# EAGLE design vent bjt2 i2c pwm (EAGLE 9.5.0)
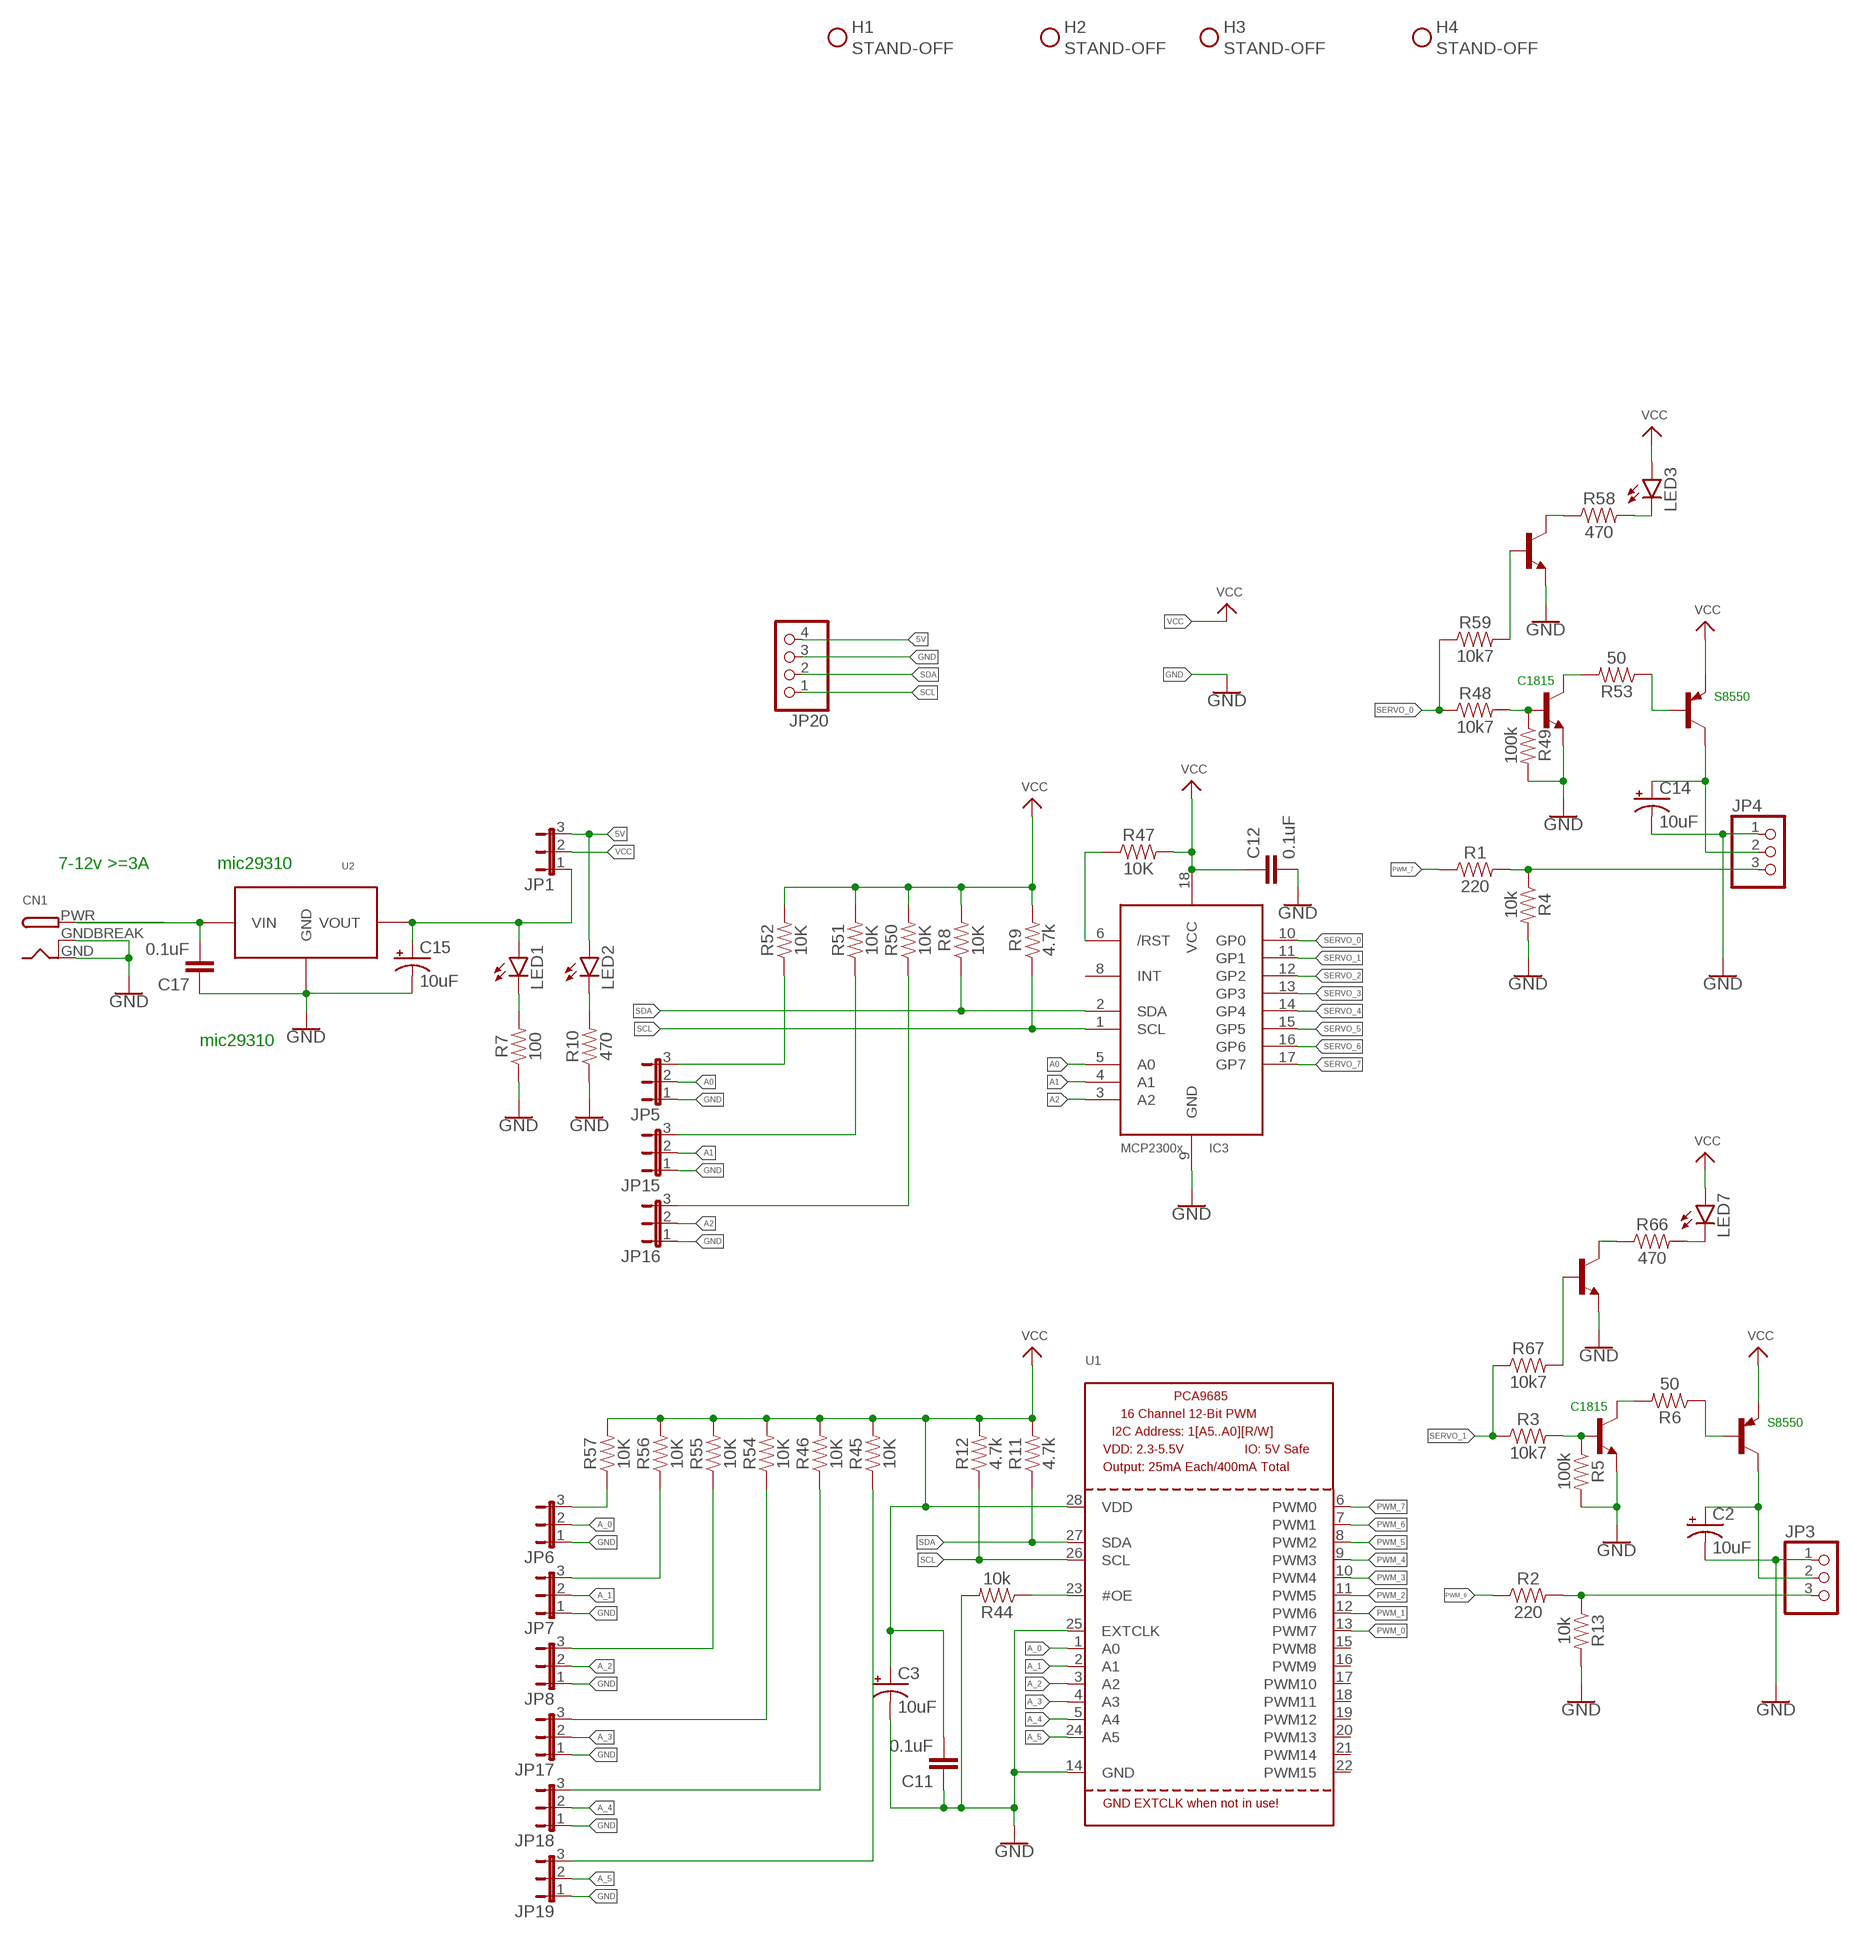
[diagram p0: schematic, sheet 1, part 1 of 2]
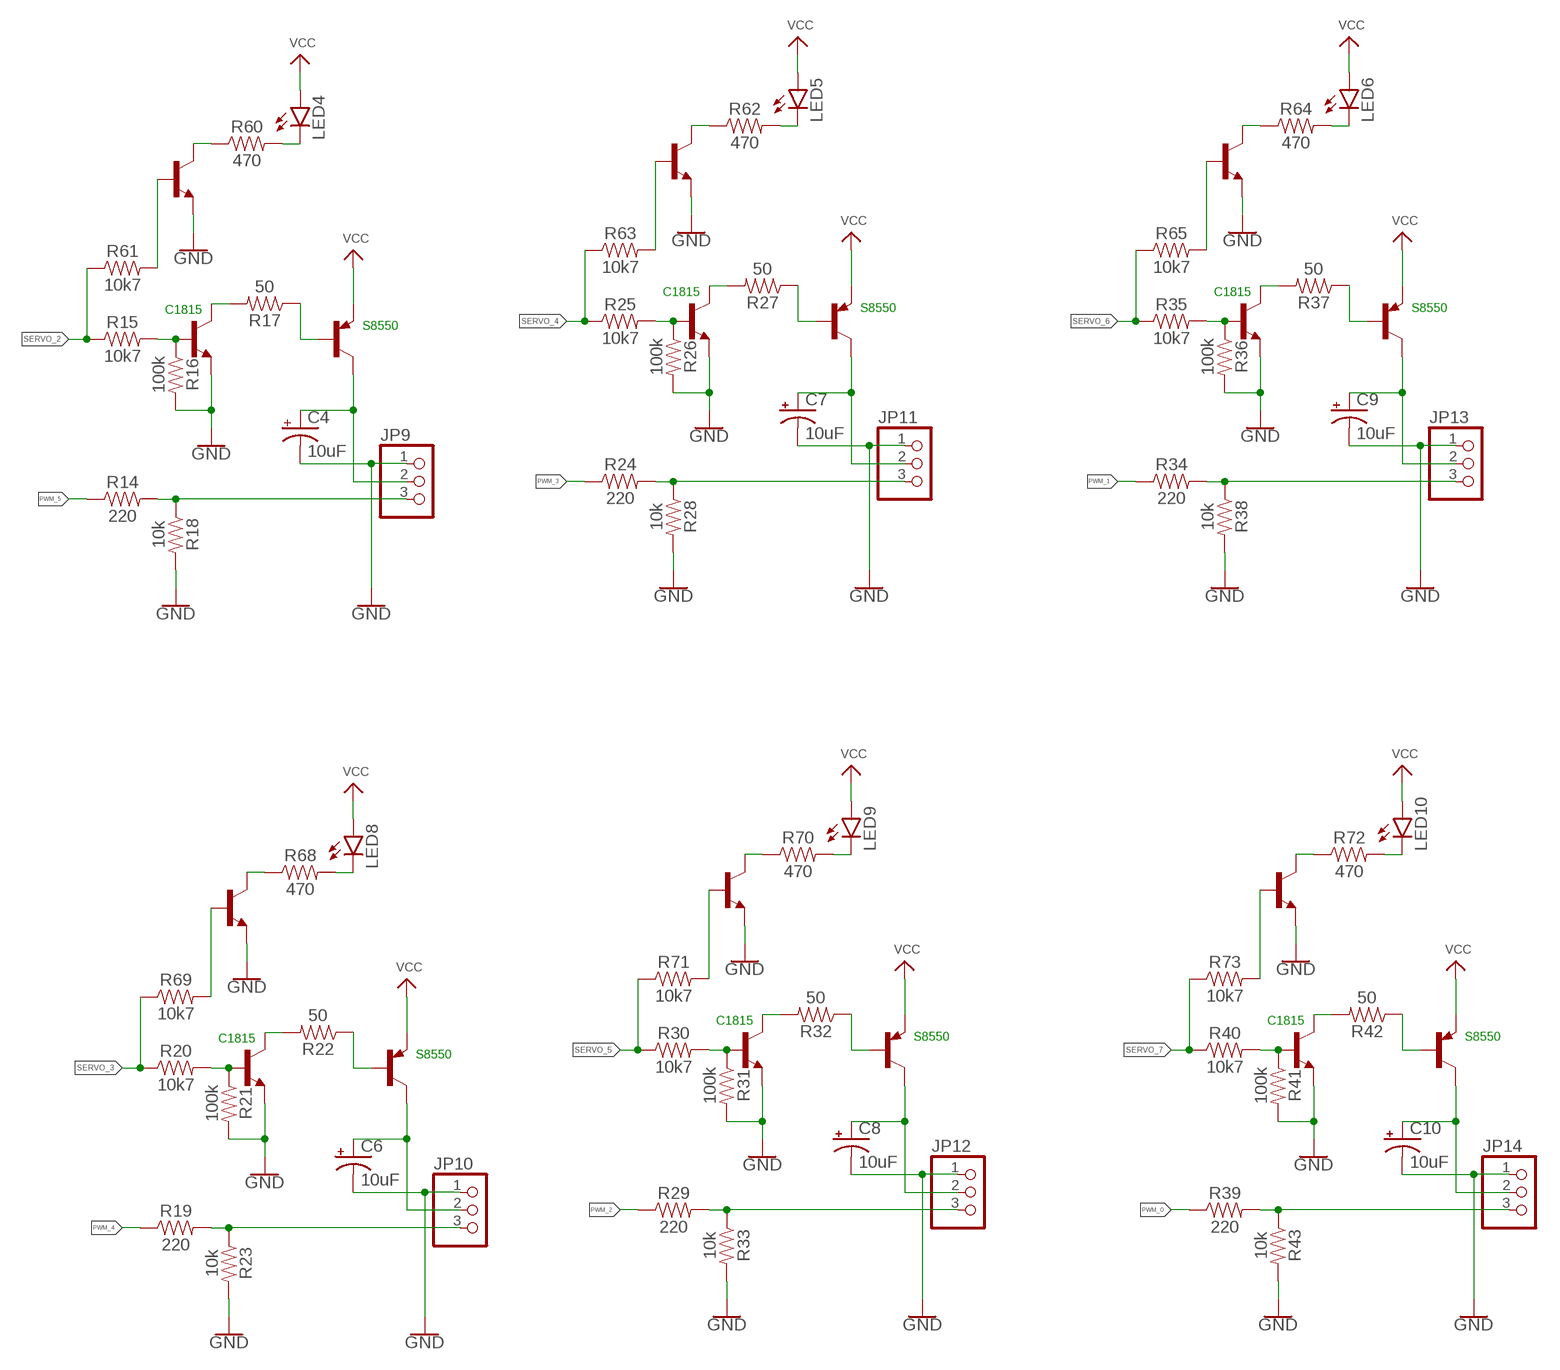
[diagram p1: schematic, sheet 1, part 2 of 2]

## Parts
C2  10uF  10UF-POLAR-RADIAL-2.5MM-25V-20%  [CPOL-RADIAL-2.5MM-5MM]
C3  10uF  10UF-POLAR-RADIAL-2.5MM-25V-20%  [CPOL-RADIAL-2.5MM-5MM]
C4  10uF  10UF-POLAR-RADIAL-2.5MM-25V-20%  [CPOL-RADIAL-2.5MM-5MM]
C6  10uF  10UF-POLAR-RADIAL-2.5MM-25V-20%  [CPOL-RADIAL-2.5MM-5MM]
C7  10uF  10UF-POLAR-RADIAL-2.5MM-25V-20%  [CPOL-RADIAL-2.5MM-5MM]
C8  10uF  10UF-POLAR-RADIAL-2.5MM-25V-20%  [CPOL-RADIAL-2.5MM-5MM]
C9  10uF  10UF-POLAR-RADIAL-2.5MM-25V-20%  [CPOL-RADIAL-2.5MM-5MM]
C10  10uF  10UF-POLAR-RADIAL-2.5MM-25V-20%  [CPOL-RADIAL-2.5MM-5MM]
C11  0.1uF  0.1UF-KIT-EZ-50V-20%  [CAP-PTH-SMALL-KIT]
C12  0.1uF  0.1UF-KIT-EZ-50V-20%  [CAP-PTH-SMALL-KIT]
C14  10uF  10UF-POLAR-RADIAL-2.5MM-25V-20%  [CPOL-RADIAL-2.5MM-5MM]
C15  10uF  10UF-POLAR-RADIAL-2.5MM-25V-20%  [CPOL-RADIAL-2.5MM-5MM]
C17  0.1uF  0.1UF-KIT-EZ-50V-20%  [CAP-PTH-SMALL-KIT]
CN1  DCBARRELPTH  [DCJACK_2MM_PTH]
H1  STAND-OFF  [STAND-OFF]
H2  STAND-OFF  [STAND-OFF]
H3  STAND-OFF  [STAND-OFF]
H4  STAND-OFF  [STAND-OFF]
IC3  MCP23008/P  [DIL18]
JP1  JP2E  [JP2]
JP3  PINHD-1X3  [1X03]
JP4  PINHD-1X3  [1X03]
JP5  JP2E  [JP2]
JP6  JP2E  [JP2]
JP7  JP2E  [JP2]
JP8  JP2E  [JP2]
JP9  PINHD-1X3  [1X03]
JP10  PINHD-1X3  [1X03]
JP11  PINHD-1X3  [1X03]
JP12  PINHD-1X3  [1X03]
JP13  PINHD-1X3  [1X03]
JP14  PINHD-1X3  [1X03]
JP15  JP2E  [JP2]
JP16  JP2E  [JP2]
JP17  JP2E  [JP2]
JP18  JP2E  [JP2]
JP19  JP2E  [JP2]
JP20  PINHD-1X4  [1X04]
LED1  LEDCHIPLED_1206  [CHIPLED_1206]
LED2  LEDCHIPLED_1206  [CHIPLED_1206]
LED3  LEDCHIPLED_1206  [CHIPLED_1206]
LED4  LEDCHIPLED_1206  [CHIPLED_1206]
LED5  LEDCHIPLED_1206  [CHIPLED_1206]
LED6  LEDCHIPLED_1206  [CHIPLED_1206]
LED7  LEDCHIPLED_1206  [CHIPLED_1206]
LED8  LEDCHIPLED_1206  [CHIPLED_1206]
LED9  LEDCHIPLED_1206  [CHIPLED_1206]
LED10  LEDCHIPLED_1206  [CHIPLED_1206]
Q1  2N2907  [TO92-EBC-OVAL]
Q2  2N2907  [TO92-EBC-OVAL]
Q3  2N2907  [TO92-EBC-OVAL]
Q4  2N2907  [TO92-EBC-OVAL]
Q5  2N2907  [TO92-EBC-OVAL]
Q6  2N2907  [TO92-EBC-OVAL]
Q7  2N2907  [TO92-EBC-OVAL]
Q9  2N2907  [TO92-EBC-OVAL]
R1  220  10KOHM-HORIZ-1/4W-1%  [AXIAL-0.3]
R2  220  10KOHM-HORIZ-1/4W-1%  [AXIAL-0.3]
R3  10k7  10KOHM-HORIZ-1/4W-1%  [AXIAL-0.3]
R4  10k  10KOHM-HORIZ-1/4W-1%  [AXIAL-0.3]
R5  100k  10KOHM-HORIZ-1/4W-1%  [AXIAL-0.3]
R6  50  10KOHM-HORIZ-1/4W-1%  [AXIAL-0.3]
R7  100  10KOHM-HORIZ-1/4W-1%  [AXIAL-0.3]
R8  10K  10KOHM-HORIZ-1/4W-1%  [AXIAL-0.3]
R9  4.7k  10KOHM-HORIZ-1/4W-1%  [AXIAL-0.3]
R10  470  10KOHM-HORIZ-1/4W-1%  [AXIAL-0.3]
R11  4.7k  10KOHM-HORIZ-1/4W-1%  [AXIAL-0.3]
R12  4.7k  10KOHM-HORIZ-1/4W-1%  [AXIAL-0.3]
R13  10k  10KOHM-HORIZ-1/4W-1%  [AXIAL-0.3]
R14  220  10KOHM-HORIZ-1/4W-1%  [AXIAL-0.3]
R15  10k7  10KOHM-HORIZ-1/4W-1%  [AXIAL-0.3]
R16  100k  10KOHM-HORIZ-1/4W-1%  [AXIAL-0.3]
R17  50  10KOHM-HORIZ-1/4W-1%  [AXIAL-0.3]
R18  10k  10KOHM-HORIZ-1/4W-1%  [AXIAL-0.3]
R19  220  10KOHM-HORIZ-1/4W-1%  [AXIAL-0.3]
R20  10k7  10KOHM-HORIZ-1/4W-1%  [AXIAL-0.3]
R21  100k  10KOHM-HORIZ-1/4W-1%  [AXIAL-0.3]
R22  50  10KOHM-HORIZ-1/4W-1%  [AXIAL-0.3]
R23  10k  10KOHM-HORIZ-1/4W-1%  [AXIAL-0.3]
R24  220  10KOHM-HORIZ-1/4W-1%  [AXIAL-0.3]
R25  10k7  10KOHM-HORIZ-1/4W-1%  [AXIAL-0.3]
R26  100k  10KOHM-HORIZ-1/4W-1%  [AXIAL-0.3]
R27  50  10KOHM-HORIZ-1/4W-1%  [AXIAL-0.3]
R28  10k  10KOHM-HORIZ-1/4W-1%  [AXIAL-0.3]
R29  220  10KOHM-HORIZ-1/4W-1%  [AXIAL-0.3]
R30  10k7  10KOHM-HORIZ-1/4W-1%  [AXIAL-0.3]
R31  100k  10KOHM-HORIZ-1/4W-1%  [AXIAL-0.3]
R32  50  10KOHM-HORIZ-1/4W-1%  [AXIAL-0.3]
R33  10k  10KOHM-HORIZ-1/4W-1%  [AXIAL-0.3]
R34  220  10KOHM-HORIZ-1/4W-1%  [AXIAL-0.3]
R35  10k7  10KOHM-HORIZ-1/4W-1%  [AXIAL-0.3]
R36  100k  10KOHM-HORIZ-1/4W-1%  [AXIAL-0.3]
R37  50  10KOHM-HORIZ-1/4W-1%  [AXIAL-0.3]
R38  10k  10KOHM-HORIZ-1/4W-1%  [AXIAL-0.3]
R39  220  10KOHM-HORIZ-1/4W-1%  [AXIAL-0.3]
R40  10k7  10KOHM-HORIZ-1/4W-1%  [AXIAL-0.3]
R41  100k  10KOHM-HORIZ-1/4W-1%  [AXIAL-0.3]
R42  50  10KOHM-HORIZ-1/4W-1%  [AXIAL-0.3]
R43  10k  10KOHM-HORIZ-1/4W-1%  [AXIAL-0.3]
R44  10k  10KOHM-HORIZ-1/4W-1%  [AXIAL-0.3]
R45  10K  10KOHM-HORIZ-1/4W-1%  [AXIAL-0.3]
R46  10K  10KOHM-HORIZ-1/4W-1%  [AXIAL-0.3]
R47  10K  10KOHM-HORIZ-1/4W-1%  [AXIAL-0.3]
R48  10k7  10KOHM-HORIZ-1/4W-1%  [AXIAL-0.3]
R49  100k  10KOHM-HORIZ-1/4W-1%  [AXIAL-0.3]
R50  10K  10KOHM-HORIZ-1/4W-1%  [AXIAL-0.3]
R51  10K  10KOHM-HORIZ-1/4W-1%  [AXIAL-0.3]
R52  10K  10KOHM-HORIZ-1/4W-1%  [AXIAL-0.3]
R53  50  10KOHM-HORIZ-1/4W-1%  [AXIAL-0.3]
R54  10K  10KOHM-HORIZ-1/4W-1%  [AXIAL-0.3]
R55  10K  10KOHM-HORIZ-1/4W-1%  [AXIAL-0.3]
R56  10K  10KOHM-HORIZ-1/4W-1%  [AXIAL-0.3]
R57  10K  10KOHM-HORIZ-1/4W-1%  [AXIAL-0.3]
R58  470  10KOHM-HORIZ-1/4W-1%  [AXIAL-0.3]
R59  10k7  10KOHM-HORIZ-1/4W-1%  [AXIAL-0.3]
R60  470  10KOHM-HORIZ-1/4W-1%  [AXIAL-0.3]
R61  10k7  10KOHM-HORIZ-1/4W-1%  [AXIAL-0.3]
R62  470  10KOHM-HORIZ-1/4W-1%  [AXIAL-0.3]
R63  10k7  10KOHM-HORIZ-1/4W-1%  [AXIAL-0.3]
R64  470  10KOHM-HORIZ-1/4W-1%  [AXIAL-0.3]
R65  10k7  10KOHM-HORIZ-1/4W-1%  [AXIAL-0.3]
R66  470  10KOHM-HORIZ-1/4W-1%  [AXIAL-0.3]
R67  10k7  10KOHM-HORIZ-1/4W-1%  [AXIAL-0.3]
R68  470  10KOHM-HORIZ-1/4W-1%  [AXIAL-0.3]
R69  10k7  10KOHM-HORIZ-1/4W-1%  [AXIAL-0.3]
R70  470  10KOHM-HORIZ-1/4W-1%  [AXIAL-0.3]
R71  10k7  10KOHM-HORIZ-1/4W-1%  [AXIAL-0.3]
R72  470  10KOHM-HORIZ-1/4W-1%  [AXIAL-0.3]
R73  10k7  10KOHM-HORIZ-1/4W-1%  [AXIAL-0.3]
T1  2SC1815  [TO92-ECB]
T2  2SC1815  [TO92-ECB]
T3  2SC1815  [TO92-ECB]
T4  2SC1815  [TO92-ECB]
T5  2SC1815  [TO92-ECB]
T6  2SC1815  [TO92-ECB]
T7  2SC1815  [TO92-ECB]
T9  2SC1815  [TO92-ECB]
U1  PCA9685  [TSSOP28]
U2  MIC29310_TO-263  [TO263-3]
U3  S9018  [TO92-EBC]
U4  S9018  [TO92-EBC]
U5  S9018  [TO92-EBC]
U6  S9018  [TO92-EBC]
U7  S9018  [TO92-EBC]
U8  S9018  [TO92-EBC]
U9  S9018  [TO92-EBC]
U10  S9018  [TO92-EBC]

## Nets
5V [power]: JP1.3 JP20.4 LED2.A
5V_REG [HI_POWER]: C15.1(+) JP1.1 LED1.A U2.3(VOUT)
A0 [Signal]: IC3.5(A0) JP5.2
A1 [Signal]: IC3.4(A1) JP15.2
A2 [Signal]: IC3.3(A2) JP16.2
A_0 [Signal]: JP6.2 U1.1(A0)
A_1 [Signal]: JP7.2 U1.2(A1)
A_2 [Signal]: JP8.2 U1.3(A2)
A_3 [Signal]: JP17.2 U1.4(A3)
A_4 [Signal]: JP18.2 U1.5(A4)
A_5 [Signal]: JP19.2 U1.24(A5)
GND [HI_POWER]: C2.2(-) C3.2(-) C4.2(-) C6.2(-) C7.2(-) C8.2(-) C9.2(-) C10.2(-) C11.1 C12.2 C14.2(-) C15.2(-) C17.1 CN1.GND CN1.GNDBREAK IC3.9(GND) JP3.1 JP4.1 JP5.1 JP6.1 JP7.1 JP8.1 JP9.1 JP10.1 JP11.1 JP12.1 JP13.1 JP14.1 JP15.1 JP16.1 JP17.1 JP18.1 JP19.1 JP20.3 R4.P$2 R5.P$2 R7.P$1 R10.P$1 R13.P$2 R16.P$2 R18.P$2 R21.P$2 R23.P$2 R26.P$2 R28.P$2 R31.P$2 R33.P$2 R36.P$2 R38.P$2 R41.P$2 R43.P$2 R44.P$2 R49.P$2 T1.E T2.E T3.E T4.E T5.E T6.E T7.E T9.E U1.14(GND) U1.25(EXTCLK) U2.2(GND) U2.TAB(GND) U3.E U4.E U5.E U6.E U7.E U8.E U9.E U10.E
N$1 [Signal]: JP4.3 R1.P$2 R4.P$1
N$2 [Signal]: JP3.3 R2.P$2 R13.P$1
N$3 [power]: Q9.B R53.P$1
N$4 [Signal]: R3.P$2 R5.P$1 T1.B
N$5 [power]: R6.P$2 T1.C
N$6 [Signal]: JP8.3 R55.P$1
N$7 [power]: C2.1(+) JP3.2 Q1.C
N$8 [HI_POWER]: C17.2 CN1.PWR U2.1(VIN)
N$9 [power]: Q1.B R6.P$1
N$10 [Signal]: JP9.3 R14.P$2 R18.P$1
N$11 [Signal]: JP6.3 R57.P$1
N$12 [Signal]: JP7.3 R56.P$1
N$13: R44.P$1 U1.23(#OE)
N$14 [Signal]: LED1.C R7.P$2
N$15 [Signal]: LED2.C R10.P$2
N$16 [power]: R58.P$1 U3.C
N$18 [Signal]: JP17.3 R54.P$1
N$19 [Signal]: JP18.3 R46.P$1
N$20 [Signal]: R15.P$2 R16.P$1 T2.B
N$21 [power]: R17.P$2 T2.C
N$22 [power]: C4.1(+) JP9.2 Q2.C
N$23 [power]: Q2.B R17.P$1
N$24: JP10.3 R19.P$2 R23.P$1
N$25 [power]: R20.P$2 R21.P$1 T3.B
N$26 [power]: R22.P$2 T3.C
N$27 [power]: C6.1(+) JP10.2 Q3.C
N$28 [power]: Q3.B R22.P$1
N$29: JP11.3 R24.P$2 R28.P$1
N$30 [power]: R25.P$2 R26.P$1 T4.B
N$31 [power]: R27.P$2 T4.C
N$32 [power]: C7.1(+) JP11.2 Q4.C
N$33 [power]: Q4.B R27.P$1
N$34: JP12.3 R29.P$2 R33.P$1
N$35 [power]: R30.P$2 R31.P$1 T5.B
N$36 [power]: R32.P$2 T5.C
N$37 [power]: C8.1(+) JP12.2 Q5.C
N$38 [power]: Q5.B R32.P$1
N$39: JP13.3 R34.P$2 R38.P$1
N$40 [power]: R35.P$2 R36.P$1 T6.B
N$41: R37.P$2 T6.C
N$42 [power]: C9.1(+) JP13.2 Q6.C
N$43 [power]: Q6.B R37.P$1
N$44 [Signal]: JP19.3 R45.P$1
N$45 [Signal]: JP5.3 R52.P$1
N$46 [Signal]: JP15.3 R51.P$1
N$47 [Signal]: JP16.3 R50.P$1
N$48 [Signal]: IC3.6(/RST) R47.P$1
N$49: JP14.3 R39.P$2 R43.P$1
N$50 [Signal]: R48.P$2 R49.P$1 T9.B
N$51 [power]: R53.P$2 T9.C
N$52 [power]: R40.P$2 R41.P$1 T7.B
N$53 [power]: C14.1(+) JP4.2 Q9.C
N$54 [power]: R42.P$2 T7.C
N$55 [power]: C10.1(+) JP14.2 Q7.C
N$56 [power]: Q7.B R42.P$1
N$57 [power]: LED3.C R58.P$2
N$58 [Signal]: R59.P$2 U3.B
N$59 [power]: R60.P$1 U4.C
N$60 [power]: LED4.C R60.P$2
N$61 [Signal]: R61.P$2 U4.B
N$62: R62.P$1 U5.C
N$63: LED5.C R62.P$2
N$64: R63.P$2 U5.B
N$65: R64.P$1 U6.C
N$66: LED6.C R64.P$2
N$67: R65.P$2 U6.B
N$68 [power]: R66.P$1 U7.C
N$69 [power]: LED7.C R66.P$2
N$70 [Signal]: R67.P$2 U7.B
N$71: R68.P$1 U8.C
N$72: LED8.C R68.P$2
N$73: R69.P$2 U8.B
N$74: R70.P$1 U9.C
N$75: LED9.C R70.P$2
N$76: R71.P$2 U9.B
N$77: R72.P$1 U10.C
N$78: LED10.C R72.P$2
N$79: R73.P$2 U10.B
PWM_0 [Signal]: R39.P$1 U1.13(PWM7)
PWM_1 [Signal]: R34.P$1 U1.12(PWM6)
PWM_2 [Signal]: R29.P$1 U1.11(PWM5)
PWM_3 [Signal]: R24.P$1 U1.10(PWM4)
PWM_4 [Signal]: R19.P$1 U1.9(PWM3)
PWM_5 [Signal]: R14.P$1 U1.8(PWM2)
PWM_6 [Signal]: R2.P$1 U1.7(PWM1)
PWM_7 [Signal]: R1.P$1 U1.6(PWM0)
SCL [Signal]: IC3.1(SCL) JP20.1 R9.P$1 R12.P$1 U1.26(SCL)
SDA [Signal]: IC3.2(SDA) JP20.2 R8.P$1 R11.P$1 U1.27(SDA)
SERVO_0 [Signal]: IC3.10(GP0) R48.P$1 R59.P$1
SERVO_1 [Signal]: IC3.11(GP1) R3.P$1 R67.P$1
SERVO_2 [Signal]: IC3.12(GP2) R15.P$1 R61.P$1
SERVO_3 [Signal]: IC3.13(GP3) R20.P$1 R69.P$1
SERVO_4 [Signal]: IC3.14(GP4) R25.P$1 R63.P$1
SERVO_5 [Signal]: IC3.15(GP5) R30.P$1 R71.P$1
SERVO_6 [Signal]: IC3.16(GP6) R35.P$1 R65.P$1
SERVO_7 [Signal]: IC3.17(GP7) R40.P$1 R73.P$1
VCC [power]: C3.1(+) C11.2 C12.1 IC3.18(VCC) JP1.2 LED3.A LED4.A LED5.A LED6.A LED7.A LED8.A LED9.A LED10.A Q1.E Q2.E Q3.E Q4.E Q5.E Q6.E Q7.E Q9.E R8.P$2 R9.P$2 R11.P$2 R12.P$2 R45.P$2 R46.P$2 R47.P$2 R50.P$2 R51.P$2 R52.P$2 R54.P$2 R55.P$2 R56.P$2 R57.P$2 U1.28(VDD)
Unconnected: IC3.8(INT) U1.15(PWM8) U1.16(PWM9) U1.17(PWM10) U1.18(PWM11) U1.19(PWM12) U1.20(PWM13) U1.21(PWM14) U1.22(PWM15)

## Notes on the sheet
- C1815 | C1815
- C1815 | C1815 | S8550 | S8550
- S8550 | S8550
- 7-12v >=3A | mic29310
- mic29310
- C1815 | C1815
- C1815 | C1815 | S8550 | S8550
- S8550 | S8550

## Library data of the parts
C2-C4 C6-C10 C14 C15 = SparkFun-Capacitors:10UF-POLAR: 10.0µF polarized capacitors A capacitor is a passive two-terminal electrical component used to store electrical energy temporarily in an electric field.; PROD_ID: CAP-08440
C11 C12 C17 = SparkFun-Capacitors:0.1UF: 0.1µF ceramic capacitors A capacitor is a passive two-terminal electrical component used to store electrical energy temporarily in an electric field.; PROD_ID: CAP-08370
CN1 = adafruit:DCBARREL: 2.0mm DC Barrel Jack DCJACK_2MM_PTH - Through Hole Jack (4UConnector: 05537)
H1-H4 = SparkFun-Hardware:STAND-OFF: Stand Off Drill holes for mechanically mounting via screws, standoffs, etc. Note: Use the keepout ring to avoid running the screw head into surrounding components. Variant Overviews STAND-OFF - Mechanical footprint for a #4 phillips button head screw. STAND-OFF-TIGHT - Mechanical footprint for a #4 phillips button head screw, Example SparkFun Products Screw - Phillips Head (1/4", 4-40, 10 pack) <https://www.sparkfun.com/products/10453> (PRT-10453) Screw - Phillips Head (1/2", 4-40, 10 pack) <https://www.sparkfun.com/products/10452> (PRT-10452) Screw - Phillips Head (3/4", 4-40, 10 pack) <https://www.sparkfun.com/products/10451> (PRT-10451) Screw - Phillips Head (1", 4-40, 10 pack) <https://www.sparkfun.com/products/10450> (PRT-10450)
IC3 = adafruit:MCP23008: MCP23008 Inexpensive i2c i/o expander - 8 general purpose i/o pins with optional pullups
JP1 JP5-JP8 JP15-JP19 = jumper:JP2E: JUMPER
JP3 JP4 JP9-JP14 = adafruit:PINHD-1X3: PIN HEADER
JP20 = pinhead:PINHD-1X4: PIN HEADER
LED1-LED10 = led:LED: LED OSRAM: - CHIPLED LG R971, LG N971, LY N971, LG Q971, LY Q971, LO R971, LY R971 LH N974, LH R974 LS Q976, LO Q976, LY Q976 LO Q996 - Hyper CHIPLED LW Q18S LB Q993, LB Q99A, LB R99A - SideLED LS A670, LO A670, LY A670, LG A670, LP A670 LB A673, LV A673, LT A673, LW A673 LH A674 LY A675 LS A676, LA A676, LO A676, LY A676, LW A676 LS A679, LY A679, LG A679 - Hyper Micro SIDELED® LS Y876, LA Y876, LO Y876, LY Y876 LT Y87S - SmartLED LW L88C, LW L88S LB L89C, LB L89S, LG L890 LS L89K, LO L89K, LY L89K LS L896, LA L896, LO L896, LY L896 - TOPLED LS T670, LO T670, LY T670, LG T670, LP T670 LSG T670, LSP T670, LSY T670, LOP T670, LYG T670 LG T671, LOG T671, LSG T671 LB T673, LV T673, LT T673, LW T673 LH T674 LS T676, LA T676, LO T676, LY T676, LB T676, LH T676, LSB T676, LW T676 LB T67C, LV T67C, LT T67C, LS T67K, LO T67K, LY T67K, LW E67C LS E67B, LA E67B, LO E67B, LY E67B, LB E67C, LV E67C, LT E67C LW T67C LS T679, LY T679, LG T679 LS T770, LO T770, LY T770, LG T770, LP T770 LB T773, LV T773, LT T773, LW T773 LH T774 LS E675, LA E675, LY E675, LS T675 LS T776, LA T776, LO T776, LY T776, LB T776 LHGB T686 LT T68C, LB T68C - Hyper Mini TOPLED® LB M676 - Mini TOPLED Santana® LG M470 LS M47K, LO M47K, LY M47K Source: http://www.osram.convergy.de LUXEON: - LUMILED® LXK2-PW12-R00, LXK2-PW12-S00, LXK2-PW14-U00, LXK2-PW14-V00 LXK2-PM12-R00, LXK2-PM12-S00, LXK2-PM14-U00 LXK2-PE12-Q00, LXK2-PE12-R00, LXK2-PE12-S00, LXK2-PE14-T00, LXK2-PE14-U00 LXK2-PB12-K00, LXK2-PB12-L00, LXK2-PB12-M00, LXK2-PB14-N00, LXK2-PB14-P00, LXK2-PB14-Q00 LXK2-PR12-L00, LXK2-PR12-M00, LXK2-PR14-Q00, LXK2-PR14-R00 LXK2-PD12-Q00, LXK2-PD12-R00, LXK2-PD12-S00 LXK2-PH12-R00, LXK2-PH12-S00 LXK2-PL12-P00, LXK2-PL12-Q00, LXK2-PL12-R00 Source: www.luxeon.com KINGBRIGHT: KA-3528ASYC Source: www.kingbright.com
Q1-Q7 Q9 = adafruit:2N2907*: PNP Transistor Big Oval pads
R1-R3 R5-R12 R14-R17 R19-R22 R24-R27 R29-R32 R34-R37 R39-R42 R45-R73 = SparkFun-Resistors:10KOHM: 10kΩ resistor A resistor is a passive two-terminal electrical component that implements electrical resistance as a circuit element. Resistors act to reduce current flow, and, at the same time, act to lower voltage levels within circuits. - Wikipedia; PROD_ID: RES-12183; VALUE: 10k
R4 R13 R18 R23 R28 R33 R38 R43 R44 = SparkFun-Resistors:10KOHM: 10kΩ resistor A resistor is a passive two-terminal electrical component that implements electrical resistance as a circuit element. Resistors act to reduce current flow, and, at the same time, act to lower voltage levels within circuits. - Wikipedia; PROD_ID: RES-12183
T1-T7 T9 = transistor:2SC1815: NPN EPITAXIAL TRANSISTOR Source: TOSHIBA .. 2SC1815 1.pdf
U1 = adafruit:PCA9685: PCA9685 - 16 Channel 12-Bit I2C PWM Controller 5.0V tolerant 16 channel, 12-bit I2C PWM controller with 25mA per output (max. 400mA total) Digikey: 568-5931-1-ND
U2 = mic29310:MIC29310_TO-263: MIC29310-5WU LDO
U3-U10 = S9018:S9018: S9018 npn BJT

## Net classes
1 power: width 0.381 mm, drill 0.203 mm, clearance 0.203 mm
2 HI_POWER: width 0.914 mm, drill 0.203 mm, clearance 0.203 mm
3 Signal: width 0.152 mm, drill 0.203 mm, clearance 0.152 mm

## Board
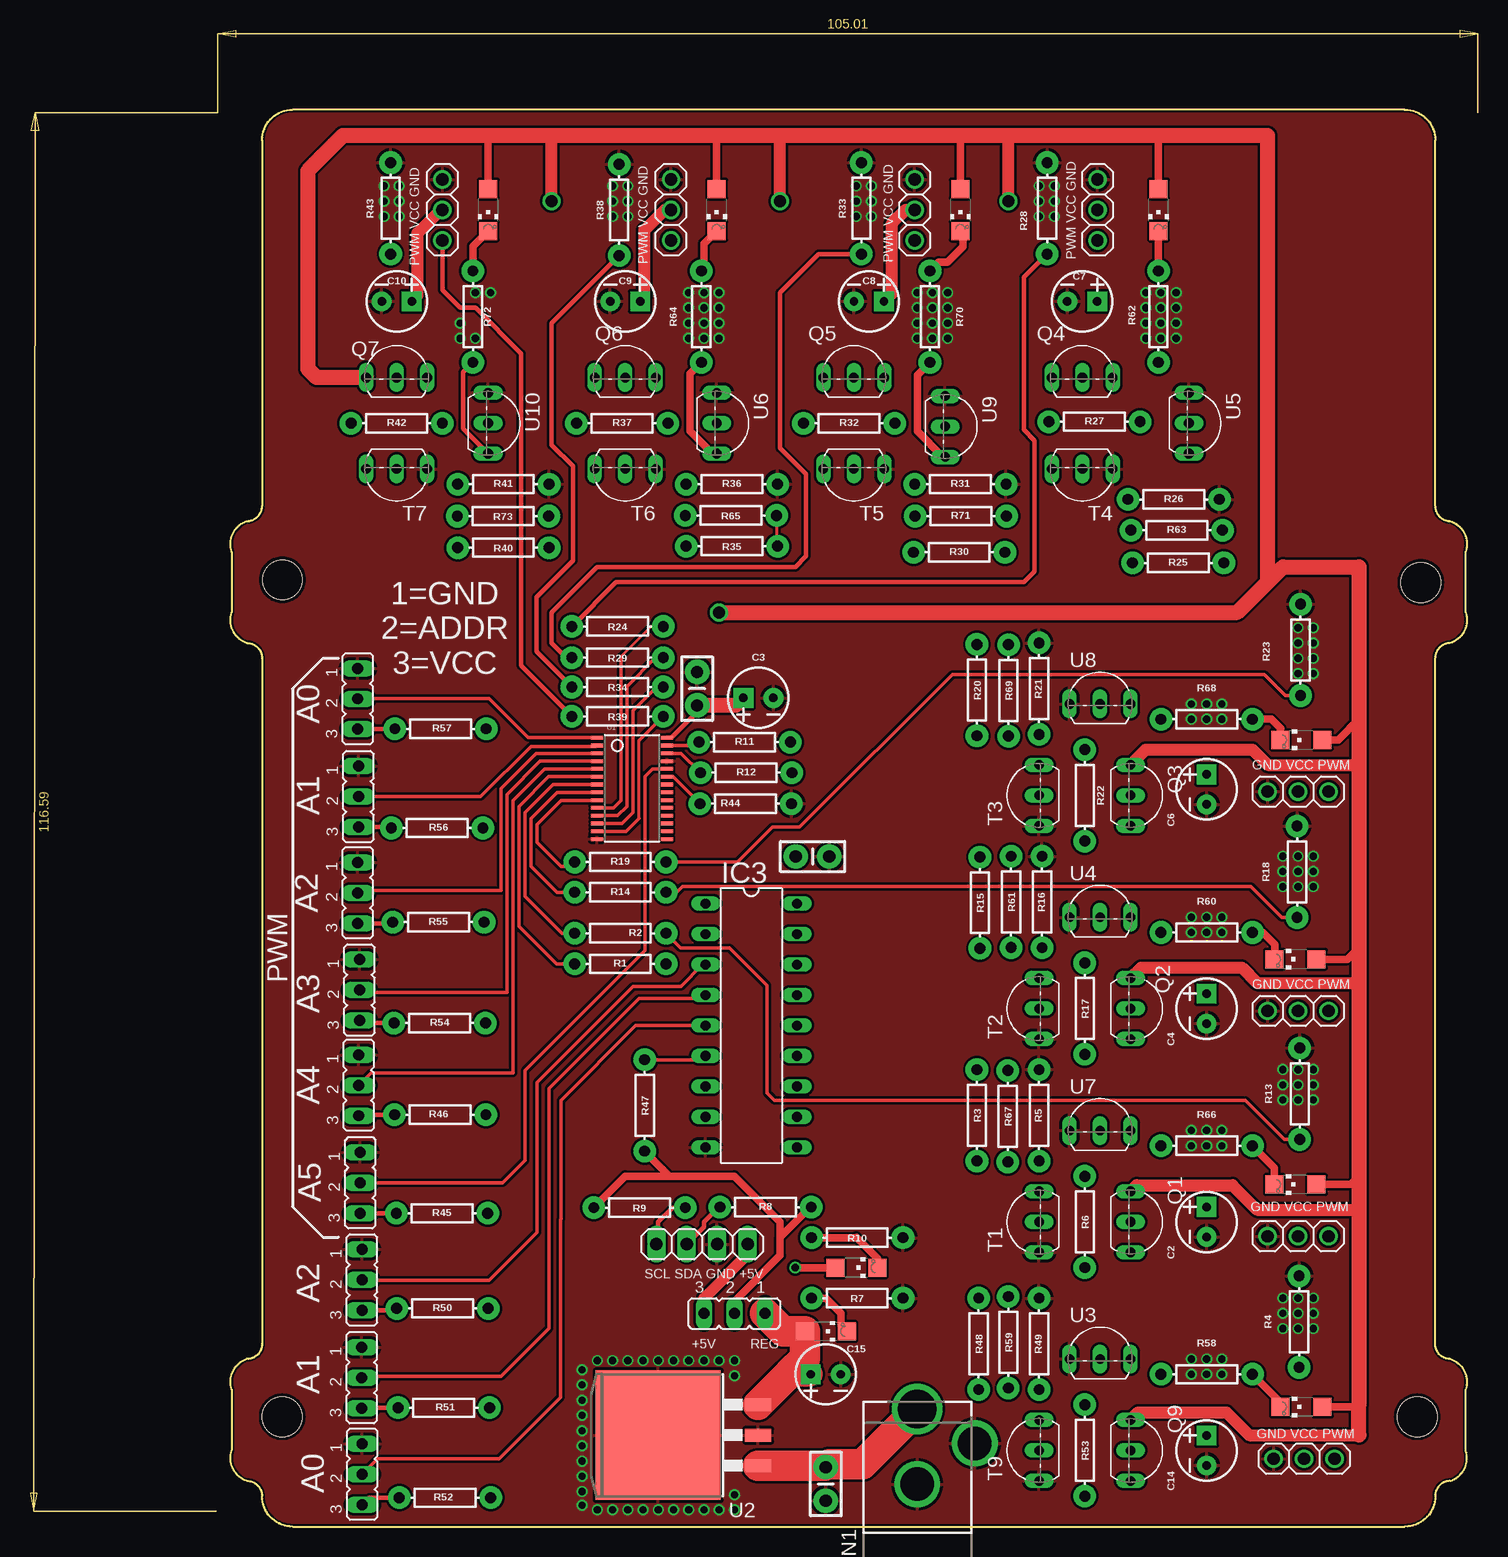
[diagram p2: board, top side]
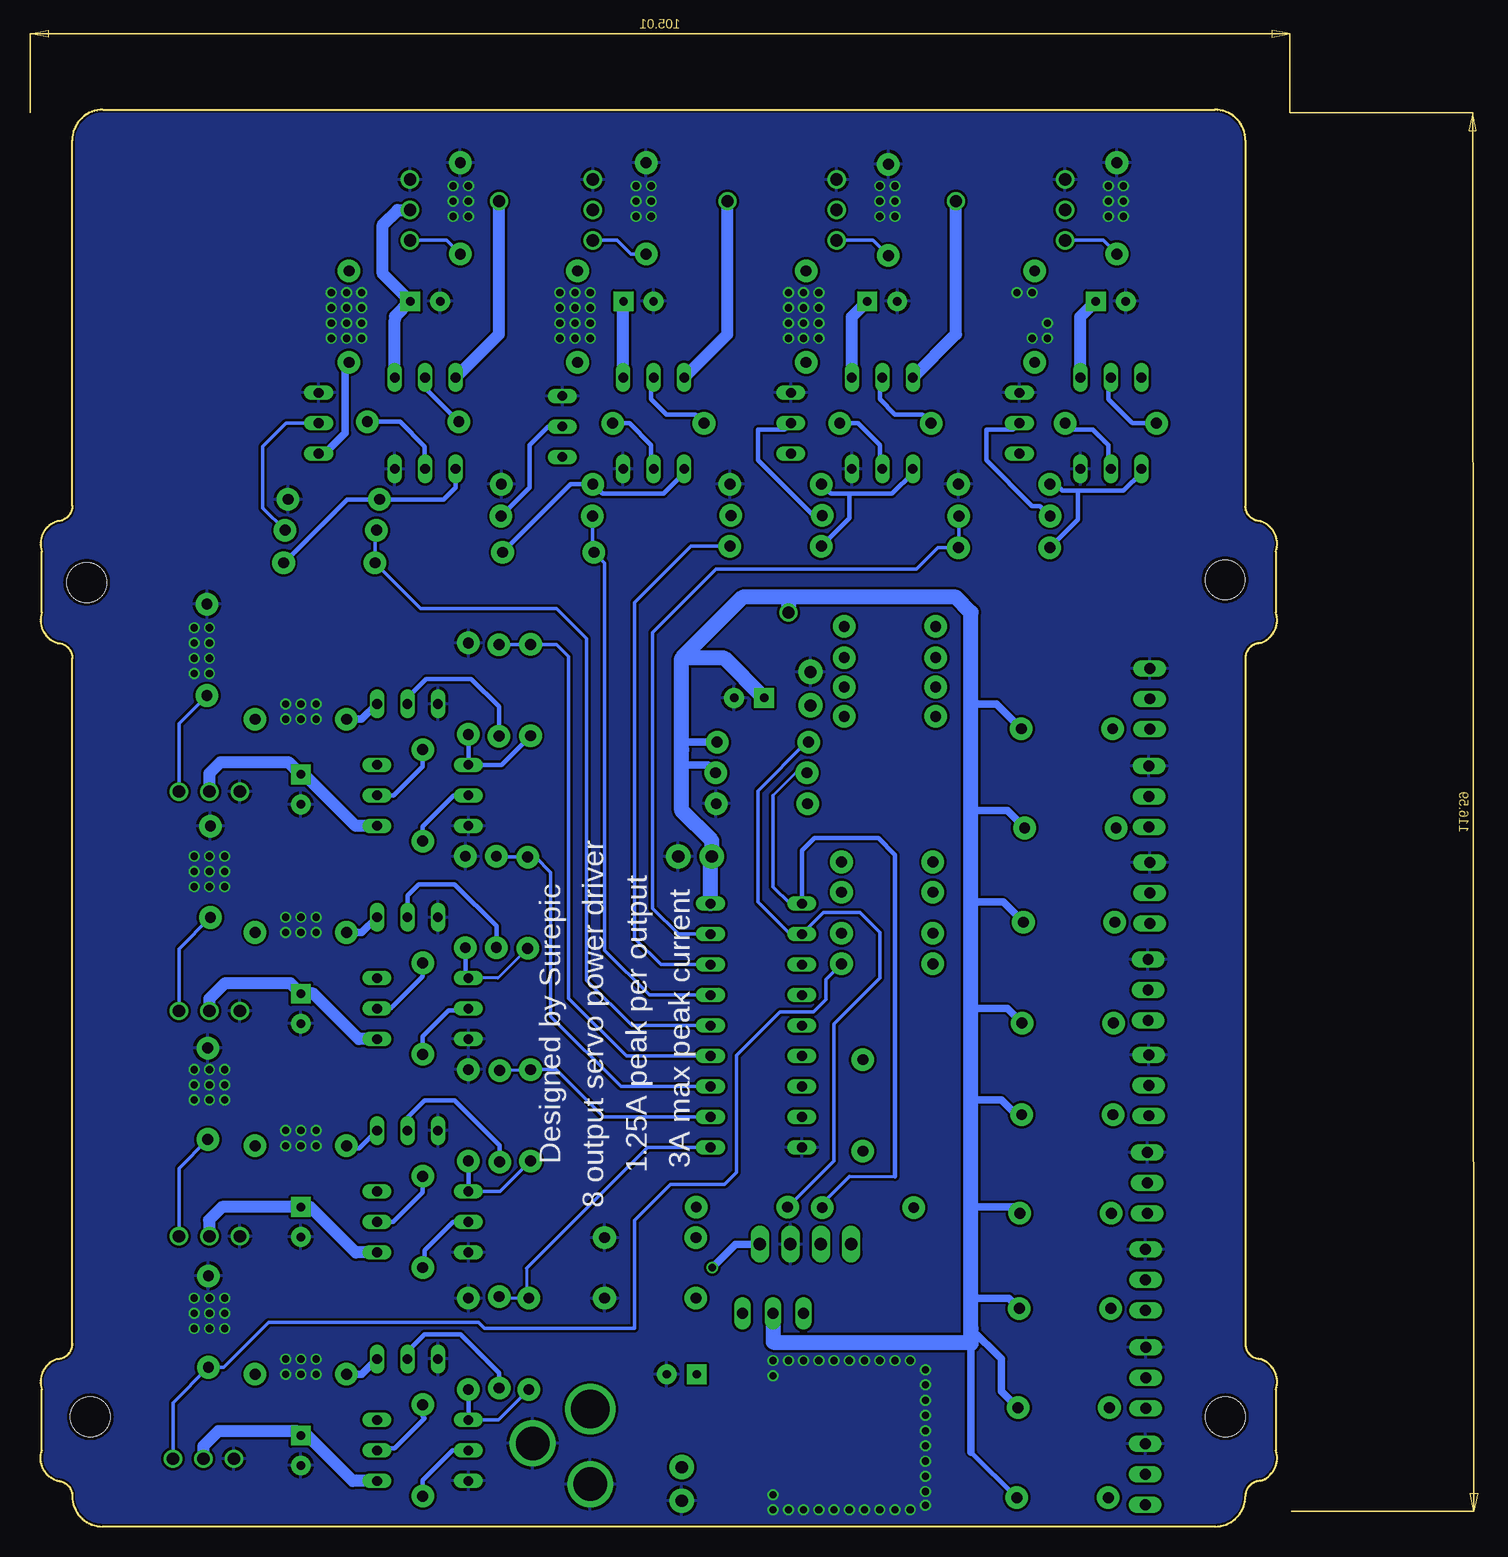
[diagram p3: board, bottom side, seen from below]

Size 103.07 x 118.11 mm. Coordinates in mm from the lower left corner, seen from the top.
Outline: 2.64,115.57 2.64,85.09 arc-90 1.37,83.82 arc90 0.1,81.28 0.1,76.2 arc90 1.37,73.66 arc-90 2.64,72.39 2.64,15.24 arc-90 1.37,13.97 arc90 0.1,11.43 0.1,6.35 arc90 1.37,3.81 arc-90 2.64,2.54 arc90 5.18,0 97.89,0 arc90 100.43,2.54 arc-90 101.7,3.81 arc90 102.97,6.35 102.97,11.43 arc90 101.7,13.97 arc-90 100.43,15.24 100.43,72.39 arc-90 101.7,73.66 arc90 102.97,76.2 102.97,81.28 arc90 101.7,83.82 arc-90 100.43,85.09 100.43,115.57 arc90 97.89,118.11 5.18,118.11 arc90 2.64,115.57
Copper layers (1*16): Top 0.035mm / dielectric 1.5mm / Bottom 0.035mm
Design rules "SparkFun-2-layer-PCBWay-LIMIT": minimum track width 6mil, minimum drill 0.3mm, track to track 6mil, track to pad 6mil, pad to pad 6mil, via to via 6mil, smd to smd 6mil, copper to edge 6mil, drill to drill 6mil, minimum pad ring 6mil, minimum via ring 6mil, stop-mask expansion 4mil, vias tented up to drill 25mil, thermal gap 10mil

### Footprints (pad centres in the part's own frame; a part is rotated, then mirrored left to right if it is on the bottom)
CPOL-RADIAL-2.5MM-5MM = drill 0.7 pad 1.651 square: 1 1.25,0 | drill 0.7 pad 1.651: 2 -1.25,0
CAP-PTH-SMALL-KIT = drill 1.016 pad 2.032: 1 -1.397,0; 2 1.397,0
DCJACK_2MM_PTH = drill 2.8: GND 0,7.35; GNDBREAK 4.8,10.75 | drill 3.2: PWR 0,13.6
STAND-OFF = hole 3.302: 0,0
DIL18 = drill 0.813 long: 1 -10.16,-3.81; 2 -7.62,-3.81; 3 -5.08,-3.81; 4 -2.54,-3.81; 5 0,-3.81; 6 2.54,-3.81; 7 5.08,-3.81; 8 7.62,-3.81; 9 10.16,-3.81; 10 10.16,3.81; 11 7.62,3.81; 12 5.08,3.81; 13 2.54,3.81; 14 0,3.81; 15 -2.54,3.81; 16 -5.08,3.81; 17 -7.62,3.81; 18 -10.16,3.81
JP2 = drill 0.914 long: 1 -2.54,0; 2 0,0; 3 2.54,0
1X03 = drill 1.016: 1 -2.54,0; 2 0,0; 3 2.54,0
1X04 = drill 1.016 long: 1 -3.81,0; 2 -1.27,0; 3 1.27,0; 4 3.81,0
CHIPLED_1206 = smd 1.5 x 1.5: A 0,-1.75; C 0,1.75
TO92-EBC-OVAL = drill 0.813 long: B 0,-1.27; C 2.54,-1.27; E -2.54,-1.27
AXIAL-0.3 = drill 0.9 pad 1.88: P$1 -3.81,0; P$2 3.81,0
TO92-ECB = drill 0.813 long: B 2.54,0; C 0,0; E -2.54,0
TSSOP28 = smd 0.305 x 0.991: 1 -4.225,-2.918; 2 -3.575,-2.918; 3 -2.925,-2.918; 4 -2.275,-2.918; 5 -1.625,-2.918; 6 -0.975,-2.918; 7 -0.325,-2.918; 8 0.325,-2.918; 9 0.975,-2.918; 10 1.625,-2.918; 11 2.275,-2.918; 12 2.925,-2.918; 13 3.575,-2.918; 14 4.225,-2.918; 15 4.225,2.918; 16 3.575,2.918; 17 2.925,2.918; 18 2.275,2.918; 19 1.625,2.918; 20 0.975,2.918; 21 0.325,2.918; 22 -0.325,2.918; 23 -0.975,2.918; 24 -1.625,2.918; 25 -2.275,2.918; 26 -2.925,2.918; 27 -3.575,2.918; 28 -4.225,2.918
TO263-3 = smd 1.067 x 2.159: 1 -2.54,-5.791; 2 0,-5.791; 3 2.54,-5.791 | smd 10.8 x 10.41: TAB 0,2.54
TO92-EBC = drill 0.813 long: B 0,-1.27; C 2.54,-1.27; E -2.54,-1.27

### Placement (x,y rotation side)
C2  81.38,25.4 90 top
C3  44.01,69.08 180 top
C4  81.38,43.18 90 top
C6  81.38,61.46 90 top
C7  71.01,102.14 0 top
C8  53.23,102.14 0 top
C9  32.91,102.14 0 top
C10  13.86,102.14 0 top
C11  38.9,69.85 270 top
C12  48.52,55.86 0 top
C14  81.38,6.35 90 top
C15  49.63,12.7 180 top
C17  49.63,3.56 90 top
CN1  57.25,-3.81 0 top
H1  99.23,78.71 0 top
H2  98.93,9.16 0 top
H3  4.31,9.16 0 top
H4  4.33,78.93 0 top
IC3  43.42,41.77 270 top
JP1  42.01,17.78 180 top
JP3  89,24.21 0 top
JP4  89.5,5.66 0 top
JP5  10.99,4.38 270 top
JP6  10.62,69.01 270 top
JP7  10.67,60.85 270 top
JP8  10.62,52.84 270 top
JP9  89,42.99 0 top
JP10  89,61.27 0 top
JP11  72.28,109.76 270 top
JP12  57.04,109.76 270 top
JP13  36.72,109.76 270 top
JP14  17.67,109.76 270 top
JP15  10.95,12.42 270 top
JP16  10.97,20.56 270 top
JP17  10.75,44.73 270 top
JP18  10.7,36.8 270 top
JP19  10.83,28.66 270 top
JP20  39.31,23.55 0 top
LED1  49.63,16.28 270 top
LED2  52.17,21.59 270 top
LED3  89.27,9.98 90 top
LED4  88.77,47.3 90 top
LED5  77.36,109.76 180 top
LED6  40.53,109.76 180 top
LED7  88.77,28.52 90 top
LED8  89.27,65.58 90 top
LED9  60.85,109.76 180 top
LED10  21.48,109.76 180 top
Q1  76.3,25.4 270 top
Q2  76.3,43.18 270 top
Q3  76.3,60.96 270 top
Q4  71.01,97.06 0 top
Q5  51.96,97.06 0 top
Q6  32.91,97.06 0 top
Q7  13.86,97.06 0 top
Q9  76.3,6.35 270 top
R1  32.5,46.91 0 top
R2  32.5,49.46 0 top
R3  62.23,34.29 270 top
R4  89.09,17.09 90 top
R5  67.41,34.29 90 top
R6  71.22,25.4 270 top
R7  52.25,19.05 180 top
R8  44.61,26.63 0 top
R9  34.1,26.59 180 top
R10  52.25,24.09 180 top
R11  42.87,65.4 0 top
R12  43,62.85 0 top
R13  89.14,36.09 90 top
R14  32.5,52.88 0 top
R15  62.48,52.01 270 top
R16  67.67,52.07 90 top
R17  71.22,43.18 270 top
R18  88.92,54.59 90 top
R19  32.5,55.4 0 top
R20  62.23,69.73 270 top
R21  67.41,69.85 90 top
R22  71.22,60.96 270 top
R23  89.2,73.09 90 top
R24  32.27,75.04 180 top
R25  79,80.34 0 top
R26  78.63,85.63 0 top
R27  72.03,92.11 0 top
R28  68.09,109.89 90 top
R29  32.27,72.44 180 top
R30  60.75,81.22 0 top
R31  60.85,86.9 0 top
R32  51.58,91.98 0 top
R33  52.6,109.89 90 top
R34  32.27,69.99 180 top
R35  41.8,81.73 180 top
R36  41.8,86.9 0 top
R37  32.66,91.98 0 top
R38  32.4,109.76 90 top
R39  32.27,67.54 180 top
R40  22.75,81.61 180 top
R41  22.75,86.9 0 top
R42  13.86,91.98 0 top
R43  13.35,109.89 90 top
R44  42.95,60.26 0 top
R45  17.64,26.12 0 top
R46  17.49,34.34 0 top
R47  34.53,35.11 270 top
R48  62.37,15.24 270 top
R49  67.41,15.24 90 top
R50  17.68,18.19 0 top
R51  17.79,9.91 0 top
R52  17.88,2.41 0 top
R53  71.22,6.35 270 top
R54  17.45,41.98 0 top
R55  17.34,50.39 0 top
R56  17.23,58.24 0 top
R57  17.51,66.51 0 top
R58  81.38,12.7 0 top
R59  64.85,15.37 270 top
R60  81.38,49.53 0 top
R61  65.08,52.08 270 top
R62  77.36,100.87 90 top
R63  78.88,83.06 0 top
R64  39.26,100.87 90 top
R65  41.72,84.29 180 top
R66  81.38,31.75 0 top
R67  64.8,34.21 270 top
R68  81.38,67.31 0 top
R69  64.86,69.71 270 top
R70  58.31,100.87 90 top
R71  60.88,84.24 0 top
R72  20.21,100.87 90 top
R73  22.72,84.24 180 top
T1  67.41,25.4 90 top
T2  67.41,43.18 90 top
T3  67.41,60.96 90 top
T4  71.01,88.17 180 top
T5  51.96,88.17 180 top
T6  32.91,88.17 180 top
T7  13.86,88.17 180 top
T9  67.41,6.35 90 top
U1  33.47,61.54 270 top
U2  38.2,7.62 90 top
U3  72.49,15.24 0 top
U4  72.49,52.07 0 top
U5  81.17,91.98 270 top
U6  41.8,91.98 270 top
U7  72.49,34.29 0 top
U8  72.49,69.85 0 top
U9  60.85,91.71 270 top
U10  22.75,91.98 270 top

### Tracks (layer width: path | path; a pad name or v marks a point on that pad's centre or on a via)
5V  (via drill 0.65)
  Top 0.61: v47.09,21.59 LED2.A
  Top 0.914: JP1.3 39.47,19.05 43.12,22.7 JP20.4
  Bottom 0.61: JP20.4 45.13,23.55 v47.09,21.59
5V_REG
  Top 2: 46.53,12.7 C15.1
  Top 2.54: U2.3 46.53,12.7 47.88,14.05 LED1.A 46.05,16.28 JP1.1
A0
  Top 0.254: 27.52,25.62 27.55,25.65
  Top 0.305: JP5.2 12.26,5.65 22.39,5.65 27.52,10.78 27.52,25.62 | 27.55,25.65 27.55,35.54 33.78,41.77 IC3.5
A1
  Top 0.254: 11.07,12.54 JP15.2
  Top 0.305: IC3.4 39.34,44.04 34.05,44.04 26.55,36.54 26.55,16.54 22.55,12.54 11.07,12.54
A2
  Top 0.254: 10.99,20.54 JP16.2
  Top 0.305: IC3.3 39.36,46.85 37.55,45.04 33.55,45.04 25.55,37.04 25.55,24.54 21.55,20.54 10.99,20.54
A_0
  Top 0.254: 10.65,69.04 JP6.2
  Top 0.305: U1.1 24.83,65.77 21.55,69.04 10.65,69.04
A_1
  Top 0.254: U1.2 30.48,65.04
  Top 0.305: 30.48,65.04 25.05,65.04 20.86,60.85 JP7.2
A_2
  Top 0.254: 10.82,53.04 JP8.2
  Top 0.305: U1.3 25.48,64.47 22.55,61.54 22.55,53.04 10.82,53.04
A_3
  Top 0.254: 10.94,44.54 JP17.2
  Top 0.305: U1.4 25.83,63.81 23.05,61.04 23.05,44.54 10.94,44.54
A_4
  Top 0.305: U1.5 26.18,63.16 23.55,60.54 23.55,37.81 11.71,37.81 JP18.2
A_5
  Top 0.305: JP19.2 22.67,28.66 24.55,30.54 24.55,38.04 34.55,48.04 34.55,62.54 35.18,63.16 U1.24
GND  (via drill 0.6)
  other vias: 29.31,4.19 29.31,5.46 29.31,6.73 29.31,8 29.31,9.27 29.31,10.54 29.31,11.81 29.31,13.08 29.31,2.92 29.31,1.78 30.58,1.4 31.85,1.4 33.12,1.4 34.39,1.4 35.66,1.4 36.93,1.4 38.2,1.4 39.47,1.4 40.74,1.4 42.01,1.4 42.01,2.67 42.01,12.57 30.58,13.84 31.85,13.84 33.12,13.84 34.39,13.84 35.66,13.84 36.93,13.84 38.2,13.84 39.47,13.84 40.74,13.84 42.01,13.84 80.11,13.97 81.38,13.97 82.65,13.97 80.11,12.7 81.38,12.7 82.65,12.7 87.73,19.05 87.73,17.78 87.73,16.51 90.27,16.51 89,16.51 90.27,17.78 89,17.78 90.27,19.05 89,19.05 76.3,99.06 78.84,99.06 78.84,100.33 77.57,99.06 77.57,100.33 78.84,101.6 78.84,102.87 77.57,101.6 76.3,100.33 68.68,110.49 76.3,101.6 77.57,102.87 76.3,102.87 68.68,111.76 67.41,111.76 58.52,99.06 58.52,100.33 59.79,99.06 68.68,109.22 67.41,110.49 53.44,111.76 67.41,109.22 59.79,100.33 58.52,101.6 57.25,99.06 59.79,101.6 52.17,111.76 38.2,99.06 52.17,110.49 59.79,102.87 57.25,100.33 57.25,101.6 58.52,102.87 53.44,110.49 52.17,109.22 39.47,99.06 38.2,100.33 38.2,101.6 39.47,100.33 40.74,99.06 53.44,109.22 57.25,102.87 33.12,111.76 40.74,100.33 39.47,101.6 40.74,101.6 31.85,111.76 31.85,110.49 40.74,102.87 39.47,102.87 33.12,110.49 31.85,109.22 33.12,109.22 38.2,102.87 20.42,99.06 12.8,111.76 12.8,110.49 14.07,111.76 19.15,99.06 19.15,100.33 21.69,102.87 12.8,109.22 14.07,110.49 14.07,109.22 20.42,102.87 80.11,33.02 81.38,33.02 82.65,33.02 80.11,31.75 81.38,31.75 82.65,31.75 80.11,50.8 81.38,50.8 82.65,50.8 80.11,49.53 81.38,49.53 82.65,49.53 80.11,68.58 81.38,68.58 82.65,68.58 82.65,67.31 81.38,67.31 80.11,67.31 89,74.93 89,72.39 89,73.66 90.27,74.93 90.27,73.66 90.27,72.39 90.27,71.12 89,71.12 87.73,55.88 89,55.88 90.27,55.88 90.27,54.61 89,54.61 87.73,54.61 89,53.34 90.27,53.34 87.73,38.1 87.73,36.83 87.73,35.56 89,38.1 89,36.83 89,35.56 90.27,38.1 90.27,36.83 90.27,35.56 87.73,53.34
  pour Top: -2.44,-2.54 -2.44,118.94 105.51,118.94 105.51,-2.54
  pour Bottom: -2.44,-1.27 -2.44,118.63 105.51,118.63 105.51,-1.27
N$1
  Bottom 0.305: JP4.3 92.04,10.33 R4.P$1 87.81,13.28 84.05,17.04 66.55,17.04 66.05,16.54 53.55,16.54 53.55,25.54 50.55,28.54 46.05,28.54 45.05,29.54 45.05,39.3 41.43,42.92 38.63,42.92 37.61,43.94 37.61,45.61 R1.P$2
N$2
  Top 0.305: R2.P$2 37.54,48.24 41.59,48.24 44.73,45.09 44.73,36.17 45.36,35.54 84.61,35.54 87.87,32.28 R13.P$1
  Bottom 0.305: R13.P$1 91.54,29.88 JP3.3
N$3
  Bottom 0.381: R53.P$1 71.22,9.21 71.05,9.04 73.55,6.54 74.84,6.54 Q9.B
N$4
  Bottom 0.305: R3.P$2 64.77,27.94 T1.B
  Bottom 0.381: T1.B R5.P$1
N$5
  Bottom 0.381: T1.C 68.69,25.4 71.05,23.04 71.05,21.76 R6.P$2
N$6
  Top 0.381: JP8.3 13.44,50.3 R55.P$1
N$7
  Bottom 0.381: 89.05,25.54 89,25.49
  Bottom 1.016: Q1.C 76.81,22.86 80.6,26.65 C2.1 87.94,26.65 89.05,25.54 | 89,25.49 JP3.2
N$8
  Top 1.016: 49.89,5.21 C17.2
  Top 1.27: C17.2 49.5,5.08
  Top 2.54: CN1.PWR 52.67,5.21 49.89,5.21 | 49.5,5.08 U2.1
N$9
  Bottom 0.381: R6.P$1 71.22,27.87 73.69,25.4 Q1.B
N$10
  Top 0.305: R14.P$2 37.19,52.88 37.68,53.37 85.06,53.37 87.65,50.78 R18.P$1
  Bottom 0.305: R18.P$1 91.54,48.16 JP9.3
N$11
  Top 0.381: JP6.3 13.66,66.47 R57.P$1
N$12
  Top 0.381: JP7.3 13.35,58.31 R56.P$1
N$13
  Top 0.305: U1.23 36.89,62.52 R44.P$1
N$14
  Top 0.254: LED1.C 50.9,16.76
  Top 0.61: 50.9,16.76 50.9,17.78 49.63,19.05 R7.P$2
N$15
  Top 0.254: 52.13,24.09 52.17,24.13
  Top 0.61: R10.P$2 52.13,24.09 | 52.17,24.13 53.92,22.38 LED2.C
N$16
  Bottom 0.61: U3.C 76.3,12.7 R58.P$1
N$18
  Top 0.381: JP17.3 10.96,41.98 R54.P$1
N$19
  Top 0.381: JP18.3 10.78,34.34 R46.P$1
N$20
  Bottom 0.254: R15.P$2 64.96,45.72 T2.B
  Bottom 0.381: R16.P$1 67.67,45.97 T2.B
N$21
  Bottom 0.381: T2.C 67.55,43.04 69.05,43.04 71.22,40.87 R17.P$2
N$22
  Bottom 1.016: Q2.C 76.56,40.64 80.35,44.43 C4.1 82.27,45.32 87.69,45.32 89,44.01 JP9.2
N$23
  Bottom 0.381: R17.P$1 71.22,45.87 73.91,43.18 Q2.B
N$24
  Top 0.305: R19.P$2 42.27,55.4 45.17,58.31 47.46,58.31 60.19,71.04 86.17,71.04 87.93,69.28 R23.P$1
  Bottom 0.305: R23.P$1 91.54,66.94 JP10.3
N$25
  Bottom 0.381: R21.P$1 T3.B 64.65,63.5 R20.P$2
N$26
  Bottom 0.381: T3.C 68.63,60.96 71.22,58.37 R22.P$2
N$27
  Bottom 1.016: Q3.C 76.81,58.42 81.1,62.71 C6.1 82.4,63.73 88.07,63.73 89,62.79 JP10.2
N$28
  Bottom 0.381: R22.P$1 71.22,63.37 73.63,60.96 Q3.B
N$29
  Top 0.381: R24.P$2 32.16,78.74 66.14,78.74 67.03,79.63 67.03,90.55 66.14,91.44 66.14,104.14 68.08,106.08 R28.P$1
  Bottom 0.305: R28.P$1 69.23,107.22 JP11.3
N$30
  Bottom 0.381: T4.B 68.47,86.62 69.46,85.63 R26.P$1 77.52,85.63 R25.P$2
N$31
  Bottom 0.381: T4.C 71.05,88.21 71.05,90.04 73.12,92.11 R27.P$2
N$32
  Bottom 0.381: 73.55,100.58 73.53,100.6
  Bottom 1.016: Q4.C 73.55,100.58 | 73.53,100.6 73.53,100.87 C7.1 74.55,104.43 74.55,108.54 73.33,109.76 JP11.2
N$33
  Bottom 0.381: R27.P$1 71.01,94.9 Q4.B
N$34
  Top 0.381: R29.P$2 27.99,72.44 26.77,73.66 26.77,76.2 30.58,80.01 47.09,80.01 47.98,80.9 47.98,87.76 45.82,89.92 45.82,102.87 49.03,106.08 R33.P$1
  Bottom 0.305: R33.P$1 53.87,106.08 55.01,107.22 JP12.3
N$35
  Bottom 0.381: R30.P$2 58.88,86.9 R31.P$1 56.25,86.11 51.16,86.11 49.42,87.84 T5.B
N$36
  Bottom 0.381: T5.C 52.17,88.38 52.17,90.17 53.98,91.98 R32.P$2
N$37
  Top 1.016: C8.1 55.12,102.78 55.12,108.6 56.28,109.76 JP12.2
  Bottom 0.381: 54.5,102.12 C8.1
  Bottom 1.016: Q5.C 54.5,102.12
N$38
  Bottom 0.381: R32.P$1 48.5,92.71 50.9,92.71 52.17,93.98 52.17,95.58 Q5.B
N$39
  Top 0.381: R34.P$2 25.5,72.95 25.5,77.47 28.55,80.52 28.55,88.39 26.77,90.17 26.77,100.32 R38.P$1
  Bottom 0.305: R38.P$1 33.67,107.22 JP13.3
N$40
  Bottom 0.381: R36.P$1 37.2,86.11 35.66,86.11 | 35.66,86.11 32.11,86.11 30.37,87.84 T6.B | R35.P$2 35.66,84.06 35.66,86.11
N$41
  Bottom 0.381: T6.C 33.12,88.38 33.12,90.17 34.93,91.98 R37.P$2
N$42
  Top 0.61: C9.1 34.52,102.5
  Top 1.016: 34.52,102.5 34.52,108.08 36.2,109.76 JP13.2
  Bottom 1.016: Q6.C 35.45,100.85 C9.1
N$43
  Bottom 0.381: R37.P$1 29.58,92.71 31.85,92.71 33.12,93.98 33.12,95.58 Q6.B
N$44
  Top 0.381: JP19.3 R45.P$1
N$45
  Top 0.381: JP5.3 11.56,2.41 R52.P$1
N$46
  Top 0.381: JP15.3 10.98,9.91 R51.P$1
N$47
  Top 0.381: JP16.3 13.7,18.02 R50.P$1
N$48
  Top 0.305: R47.P$1 39.3,38.92 IC3.6
N$49
  Top 0.381: R39.P$2 24.23,71.77 24.23,97.79 20.42,101.6 19.15,101.6 17.67,103.08 JP14.3
  Bottom 0.305: R43.P$1 14.5,107.22 JP14.3
N$50
  Bottom 0.305: R48.P$2 64.91,8.89 T9.B
  Bottom 0.381: T9.B R49.P$1
N$51
  Bottom 0.381: T9.C 68.74,6.35 71.22,3.87 R53.P$2
N$52
  Bottom 0.381: R41.P$1 18.42,86.9 17.88,86.36 16.61,86.36 | 16.61,86.36 12.8,86.36 11.32,87.84 T7.B | R40.P$2 16.61,83.94 16.61,86.36
N$53
  Bottom 1.016: Q9.C 77.06,3.81 80.85,7.6 C14.1 81.76,7.98 88.24,7.98 89.5,6.72 JP4.2
N$54
  Bottom 0.381: T7.C 14.07,88.38 14.07,90.17 15.34,91.44 17.13,91.44 R42.P$2
N$55
  Top 0.61: C10.1 15.6,102.62
  Top 1.016: 15.6,102.62 15.6,107.82 17.53,109.76 JP14.2
  Bottom 1.016: Q7.C 16.4,100.85 C10.1
N$56
  Bottom 0.381: R42.P$1 12.07,91.98 14.07,93.98 14.07,95.58 Q7.B
N$57
  Top 0.61: R58.P$2 87.52,10.37 LED3.C
N$58
  Bottom 0.381: R59.P$2 64.85,12.84 68.05,16.04 71.05,16.04 72.49,14.6 U3.B
N$59
  Bottom 0.61: U4.C 76.3,49.53 R60.P$1
N$60
  Top 0.381: 87.05,47.33 LED4.C
  Top 0.61: R60.P$2 86.06,49.53 87.05,48.54 87.05,47.33
N$61
  Bottom 0.381: R61.P$2 65.08,50.07 68.55,53.54 71.55,53.54 72.49,52.6 U4.B
N$62
  Bottom 0.61: U5.C 79.39,89.44 77.67,91.16 77.67,96.75 R62.P$1
N$63
  Top 0.61: R62.P$2 LED5.C
N$64
  Bottom 0.305: R63.P$2 84.55,84.92 84.55,90.04 82.61,91.98 U5.B
N$65
  Top 0.61: U6.C 40.2,89.44 38.33,91.31 38.33,96.13 R64.P$1
N$66
  Top 0.381: R64.P$2 39.47,104.89
  Top 0.61: LED6.C 39.47,106.95 39.47,104.89
N$67
  Bottom 0.381: R65.P$2 37.95,84.33 38.71,84.33 43.28,88.9 43.28,91.44 41.07,91.44 U6.B
N$68
  Bottom 0.381: U7.C 76.51,31.54 77.36,31.54 R66.P$1
N$69
  Top 0.61: R66.P$2 87.02,29.92 LED7.C
N$70
  Bottom 0.381: R67.P$2 64.8,31.79 68.55,35.54 71.05,35.54 72.49,34.1 U7.B
N$71
  Bottom 0.61: U8.C 76.3,67.31 R68.P$1
N$72
  Top 0.381: 87.55,66.54 87.52,66.51
  Top 0.61: R68.P$2 86.78,67.31 87.55,66.54 | 87.52,66.51 LED8.C
N$73
  Bottom 0.381: R69.P$2 64.86,68.35 67.18,70.67 70.92,70.67 72.49,69.1 U8.B
N$74
  Top 0.381: U9.C 59.39,89.17
  Top 0.61: 59.39,89.17 57.25,91.31 57.25,96 R70.P$1
N$75
  Top 0.381: 61.06,107.95 61,108.01
  Top 0.61: R70.P$2 59.04,105.41 59.79,105.41 61.06,106.68 61.06,107.95 | 61,108.01 LED9.C
N$76
  Bottom 0.381: R71.P$2 62.33,86.6 62.33,90.17 60.79,91.71 U9.B
N$77
  Top 0.381: U10.C 19.41,91.52 19.41,96.25 R72.P$1
N$78
  Top 0.61: R72.P$2 20.21,106.74 LED10.C
N$79
  Bottom 0.381: R73.P$2 19.76,85.09 20.42,85.09 24.23,88.9 24.23,91.44 22.02,91.44 U10.B
PWM_0
  Top 0.254: 34.05,59.04 34.05,65.54 | 36.05,67.54 R39.P$1
  Top 0.305: U1.13 32.98,57.96 34.05,59.04 | 34.05,65.54 36.05,67.54
PWM_1
  Top 0.305: U1.12 32.63,58.62 33.55,59.54 33.55,68.04 35.5,69.99 R34.P$1
PWM_2
  Top 0.305: U1.11 32.28,59.27 33.05,60.04 33.05,70.04 35.45,72.44 R29.P$1
PWM_3
  Top 0.254: 32.55,72.54 35.05,75.04
  Top 0.305: U1.10 31.93,59.91 32.55,60.54 32.55,72.54 | 35.05,75.04 R24.P$1
PWM_4
  Top 0.254: U1.9 30.53,60.54 | 28.33,55.04 R19.P$1
  Top 0.305: 30.53,60.54 27.55,60.54 25.55,58.54 25.55,57.04 27.55,55.04 28.33,55.04
PWM_5
  Top 0.305: U1.8 27.23,61.21 25.05,59.04 25.05,55.04 27.21,52.88 R14.P$1
PWM_6
  Top 0.305: U1.7 26.88,61.87 24.55,59.54 24.55,52.54 27.63,49.46 R2.P$1
PWM_7
  Top 0.305: U1.6 26.53,62.52 24.05,60.04 24.05,50.04 27.18,46.91 R1.P$1
SCL
  Top 0.305: U1.26 37.57,64.47 R12.P$1
  Top 0.381: JP20.1 35.66,23.71 35.66,25.4 36.85,26.59 R9.P$1
  Bottom 0.254: R9.P$1 37.91,26.96 | 35.66,29.21 31.85,29.21 | 39.65,63.32 42.01,60.96
  Bottom 0.305: 37.91,26.96 35.66,29.21 | R12.P$1 39.65,63.32 | IC3.1 40.6,51.93 42.01,53.34 42.01,60.96
  Bottom 0.381: 31.85,29.21 31.85,56.01 33.25,57.4 38.58,57.4 39.61,56.38 IC3.1
SDA
  Top 0.305: U1.27 38.78,65.12 R11.P$1
  Top 0.381: JP20.2 39.47,24.98 39.47,25.4 40.7,26.63 R8.P$1
  Bottom 0.254: 37.07,51.19 37.08,51.18 | 39.47,49.53 IC3.2
  Bottom 0.305: R8.P$1 36.93,30.5 36.93,41.91 33.12,45.72 33.12,49.53 34.78,51.19 37.07,51.19 | 37.08,51.18 37.82,51.18 39.47,49.53 40.74,49.53 43.28,52.07 43.28,61.34 39.23,65.4 R11.P$1
SERVO_0
  Bottom 0.254: R59.P$1 64.72,19.05 R48.P$1 62.55,19.23 62.55,21.54
  Bottom 0.305: IC3.10 52.48,31.61 62.55,21.54
SERVO_1
  Bottom 0.254: R3.P$1 62.31,38.02 R67.P$1
  Bottom 0.305: IC3.11 56.16,34.15 60.11,38.1 R3.P$1
SERVO_2
  Bottom 0.254: 61.83,55.82 R15.P$1 | 65.01,55.82 R61.P$1
  Bottom 0.305: IC3.12 54.7,36.69 60.55,42.54 60.55,54.54 61.83,55.82 | R15.P$1 65.01,55.82
SERVO_3
  Bottom 0.254: 64.84,73.54 R69.P$1
  Bottom 0.305: IC3.13 54.24,39.23 59.05,44.04 59.05,72.54 60.05,73.54 R20.P$1 64.84,73.54
SERVO_4
  Bottom 0.305: IC3.14 53.78,41.77 57.55,45.54 57.55,74.04 60.05,76.54 71.4,76.54 R25.P$1 75.19,82.94 R63.P$1
SERVO_5
  Bottom 0.254: R30.P$1 57.07,81.35
  Bottom 0.305: IC3.15 52.32,44.31 56.05,48.04 56.05,80.33 R30.P$1 | 57.07,81.35 R71.P$1
SERVO_6
  Top 0.254: R65.P$1 45.53,81.81 R35.P$1
  Bottom 0.305: IC3.16 51.36,46.85 53.55,49.04 53.55,77.04 48.86,81.73 R35.P$1
SERVO_7
  Bottom 0.254: 26.53,81.64 R40.P$1
  Bottom 0.305: IC3.17 49.9,49.39 52.05,51.54 52.05,74.54 46.78,79.81 30.05,79.81 28.26,81.61 R40.P$1 | R73.P$1 26.53,81.64
VCC  (via drill 1)
  Top 0.381: U1.28 36.78,65.77 38.9,67.89 | 48.32,26.63 R8.P$2 | 21.48,115.36 22.07,115.95 | 40.53,115.36 41.12,115.95 | 60.85,115.36 61.44,115.95
  Top 0.61: 38.9,67.89 C11.2 | 45.82,24.13 45.82,22.61 42.01,18.8 JP1.2 | 45.82,24.13 48.32,26.63 | R47.P$2 36.62,29.21 | 36.62,29.21 42.01,29.21 45.82,25.4 45.82,24.13 | R9.P$2 32.91,29.21 36.62,29.21 | LED3.A 93.9,9.98 94.08,10.16 | LED7.A 93.39,28.52 94.08,29.21 | LED4.A 93.12,47.3 94.08,48.26 | LED8.A 92.35,65.58 94.08,67.31 | LED10.A 21.48,115.36 | LED6.A 40.53,115.36 | LED9.A 60.85,115.36 | LED5.A 77.36,115.95
  Top 1.016: Q9.E 75.67,9.53 83.03,9.53 84.94,7.62 94.08,7.62 | Q1.E 75.54,28.45 83.54,28.45 85.57,26.42 94.08,26.42 | Q2.E 75.92,46.61 84.3,46.61 85.57,45.34 94.08,45.34 | Q3.E 76.3,64.77 85.19,64.77 86.46,63.5 94.08,63.5 | v26.77,110.49 26.77,115.95 | v45.82,110.49 45.82,115.95 | v64.87,110.49 64.87,115.95
  Top 1.27: C3.1 42.13,68.45 C11.2 | v40.74,76.2 83.92,76.2 86.46,78.74 | 86.46,78.74 87.73,80.01 94.08,80.01 94.08,67.31 94.08,63.5 94.08,48.26 94.08,45.34 94.08,29.21 94.08,26.42 94.08,10.16 94.08,7.62 | 86.46,78.74 86.46,115.95 77.36,115.95 64.87,115.95 61.44,115.95 45.82,115.95 41.12,115.95 26.77,115.95 22.07,115.95 9.37,115.95 6.45,113.03 6.45,96.52 7.18,95.79 Q7.E
  Bottom 0.381: R52.P$2 25.5,6.22 | R46.P$2 21.74,34.34 | 49,65.4 49.63,64.77 | 47.23,55.75 C12.1
  Bottom 0.61: 25.5,6.22 25.5,15.24 | R51.P$2 22.96,11.27 22.96,13.97 25.5,16.51 | R50.P$2 22.35,19.05 25.5,19.05 | R45.P$2 22,26.67 25.5,26.67 | 21.74,34.34 22.96,35.56 25.5,35.56 | R54.P$2 22.46,43.18 25.5,43.18 | R55.P$2 22.83,52.07 25.5,52.07 | R56.P$2 22.49,59.69 25.5,59.69 | R57.P$2 23.39,68.58 25.5,68.58 | R12.P$2 47.46,63.5 49.63,63.5 | R11.P$2 49,65.4
  Bottom 1.016: Q6.E 26.77,99.39 v26.77,110.49 | Q5.E 45.82,99.39 v45.82,110.49 | Q4.E 64.87,99.39 v64.87,110.49
  Bottom 1.27: JP1.2 42.01,15.37 25.5,15.37 | 49.63,72.39 49.63,64.77 49.63,63.5 49.63,59.69 47.12,57.18 C12.1 | 40.74,77.47 26.77,77.47 25.5,76.2 25.5,68.58 25.5,59.69 25.5,52.07 25.5,43.18 25.5,35.56 25.5,26.67 25.5,19.05 25.5,16.51 25.5,15.37 | 40.74,77.47 44.55,77.47 49.63,72.39 | C3.1 46.07,72.39 49.63,72.39 | 40.74,77.47 v40.74,76.2 | IC3.18 47.23,55.75 | 25.5,15.24 25.5,15.37

### Text on the board
tPlace: PWM VCC GND | PWM VCC GND | PWM VCC GND | PWM VCC GND | 1=GND / 2=ADDR / 3=VCC | A0 | GND VCC PWM | A1 | A2 | PWM | GND VCC PWM | A3 | A4 | A5 | GND VCC PWM | SCL SDA GND +5V | A2 | +5V | REG | A1 | GND VCC PWM | A0
bPlace: Designed by Surepic / / 8 output servo power driver / / 1.25A peak per output / / 3A max peak current